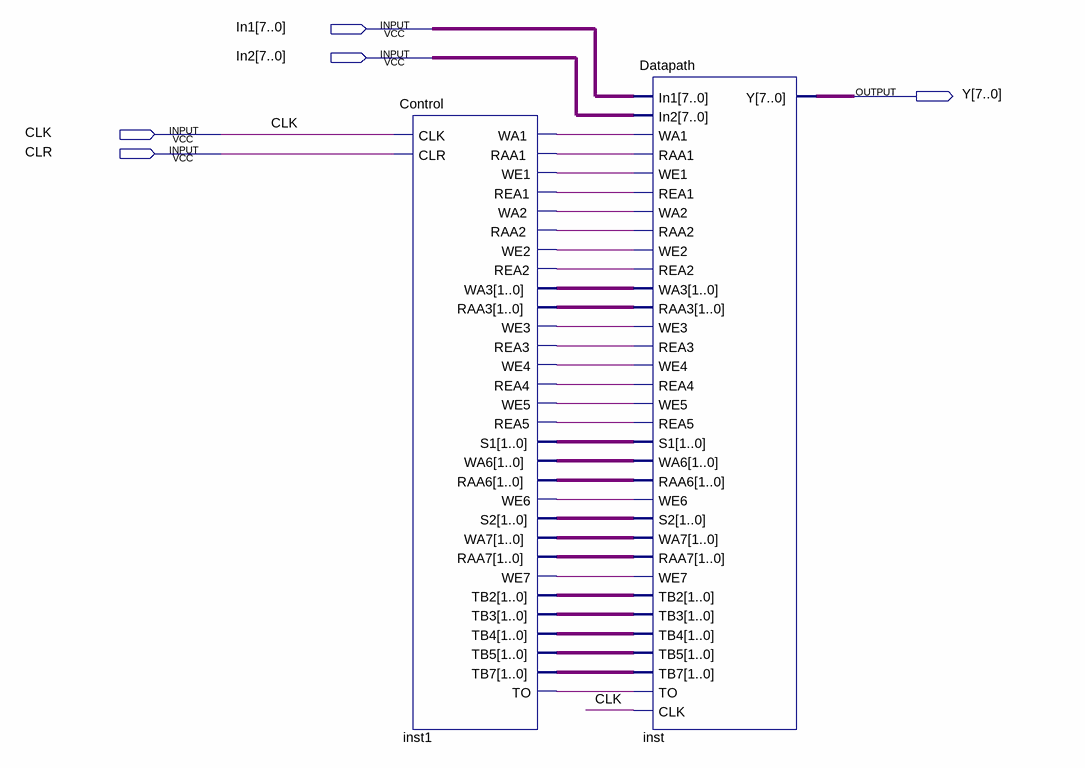
[diagram p0: schematic sheet]
// Quartus schematic BaiTap.bdf as structural Verilog: 2 symbols, 5 pins
module BaiTap (
  input  [7:0] In1,
  input  [7:0] In2,
  input  CLK,
  input  CLR,
  output [7:0] Y
);

  wire inst1_raa1, inst1_raa2, inst1_rea1, inst1_rea2, inst1_rea3, inst1_rea4, inst1_rea5, inst1_to,
       inst1_wa1, inst1_wa2, inst1_we1, inst1_we2, inst1_we3, inst1_we4, inst1_we5, inst1_we6, inst1_we7;
  wire [1:0] inst1_raa3, inst1_raa6, inst1_raa7, inst1_s1, inst1_s2, inst1_tb2, inst1_tb3, inst1_tb4,
       inst1_tb5, inst1_tb7, inst1_wa3, inst1_wa6, inst1_wa7;

  Control inst1 (
    .CLK(CLK), .CLR(CLR), .WA1(inst1_wa1), .RAA1(inst1_raa1), .WE1(inst1_we1), .REA1(inst1_rea1),
    .WA2(inst1_wa2), .RAA2(inst1_raa2), .WE2(inst1_we2), .REA2(inst1_rea2), .WA3(inst1_wa3),
    .RAA3(inst1_raa3), .WE3(inst1_we3), .REA3(inst1_rea3), .WE4(inst1_we4), .REA4(inst1_rea4),
    .WE5(inst1_we5), .REA5(inst1_rea5), .S1(inst1_s1), .WA6(inst1_wa6), .RAA6(inst1_raa6), .WE6(inst1_we6),
    .S2(inst1_s2), .WA7(inst1_wa7), .RAA7(inst1_raa7), .WE7(inst1_we7), .TB2(inst1_tb2), .TB3(inst1_tb3),
    .TB4(inst1_tb4), .TB5(inst1_tb5), .TB7(inst1_tb7), .TO(inst1_to));
  Datapath inst (
    .In1(In1), .In2(In2), .WA1(inst1_wa1), .RAA1(inst1_raa1), .WE1(inst1_we1), .REA1(inst1_rea1),
    .WA2(inst1_wa2), .RAA2(inst1_raa2), .WE2(inst1_we2), .REA2(inst1_rea2), .WA3(inst1_wa3),
    .RAA3(inst1_raa3), .WE3(inst1_we3), .REA3(inst1_rea3), .WE4(inst1_we4), .REA4(inst1_rea4),
    .WE5(inst1_we5), .REA5(inst1_rea5), .S1(inst1_s1), .WA6(inst1_wa6), .RAA6(inst1_raa6), .WE6(inst1_we6),
    .S2(inst1_s2), .WA7(inst1_wa7), .RAA7(inst1_raa7), .WE7(inst1_we7), .TB2(inst1_tb2), .TB3(inst1_tb3),
    .TB4(inst1_tb4), .TB5(inst1_tb5), .TB7(inst1_tb7), .TO(inst1_to), .CLK(CLK), .Y(Y));
endmodule
